# EAGLE design busyIdleDetectionStratasys (EAGLE 7.1.0)
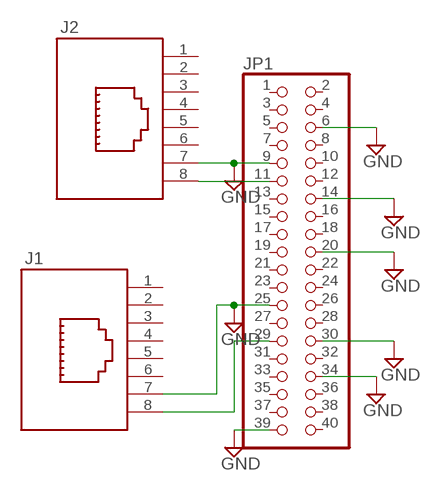
[diagram p0: schematic, sheet 1]

## Parts
J1  634008137221  [634008137221]
J2  634008137221  [634008137221]
JP1  PINHD-2X20  [2X20]

## Nets
GND: J1.7 J2.7 JP1.6 JP1.9 JP1.14 JP1.20 JP1.25 JP1.30 JP1.34 JP1.39
N$3: J2.8 JP1.11
N$4: J1.8 JP1.29
Unconnected: J1.1 J1.2 J1.3 J1.4 J1.5 J1.6 J2.1 J2.2 J2.3 J2.4 J2.5 J2.6 JP1.1 JP1.2 JP1.3 JP1.4 JP1.5 JP1.7 JP1.8 JP1.10 JP1.12 JP1.13 JP1.15 JP1.16 JP1.17 JP1.18 JP1.19 JP1.21 JP1.22 JP1.23 JP1.24 JP1.26 JP1.27 JP1.28 JP1.31 JP1.32 JP1.33 JP1.35 JP1.36 JP1.37 JP1.38 JP1.40

## Library data of the parts
J1 J2 = EAGLE-INPUT_OUTPUT_CONNECTORS-rev17d:634008137221: WR-MJ Horizontal Plastic SMT 8P8C Modular Jack Tab Down, 8 Pins=>Code : Con_I-O_MJ-H_Plastic_Down_634008137221 <http://katalog.we-online.de/media/images/eican/Con_I-O_MJ-H_Plastic_Down_634008137221_pf2.jpg> Details see: http://katalog.we-online.de/en/em/MJ_SMT_HORIZONTAL_PLASTIC_8P8C_TAB_DOWN/634008137221 Created 2014-07-10, Karrer Zheng 2014 (C) Würth Elektronik
JP1 = pinhead:PINHD-2X20: PIN HEADER

## Board
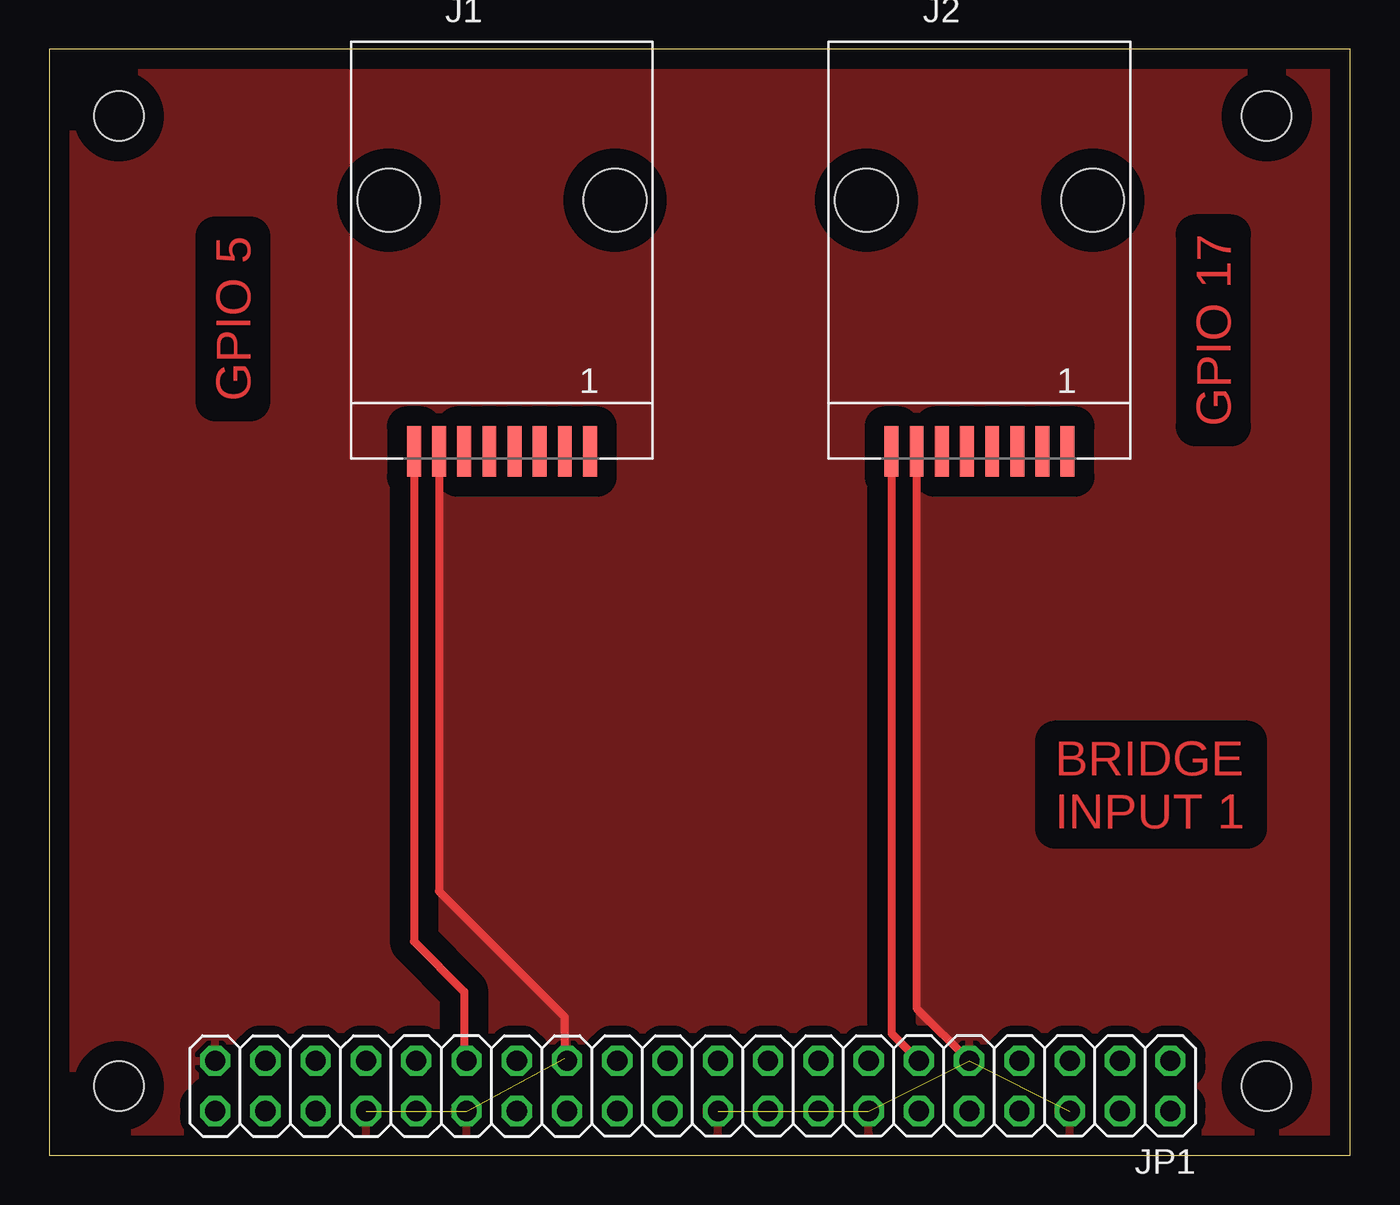
[diagram p1: board, top side]

Size 65.71 x 55.87 mm. Coordinates in mm from the lower left corner, seen from the top.
Outline: 0,0 65.71,0 65.71,55.87 0,55.87 0,0
Copper layers (1*16): Top 0.035mm / dielectric 1.5mm / Bottom 0.035mm
Design rules "default": minimum track width 10mil, minimum drill 24mil, track to track 8mil, track to pad 8mil, pad to pad 8mil, via to via 8mil, smd to smd 8mil, copper to edge 40mil, drill to drill 8mil, minimum pad ring 10mil, minimum via ring 8mil, stop-mask expansion 4mil, vias tented up to drill 0mil, thermal gap 10mil
Holes 2.5 mm at 3.5,3.5 61.5,3.5 3.5,52.5 61.5,52.5

### Footprints (pad centres in the part's own frame; a part is rotated, then mirrored left to right if it is on the bottom)
634008137221 = smd 0.7 x 2.54: 1 4.445,0; 2 3.175,0; 3 1.905,0; 4 0.635,0; 5 -0.635,0; 6 -1.905,0; 7 -3.175,0; 8 -4.445,0 | hole 3.17: 5.715,12.7; -5.715,12.7
2X20 = drill 1.016 octagon: 1 -24.13,-1.27; 2 -24.13,1.27; 3 -21.59,-1.27; 4 -21.59,1.27; 5 -19.05,-1.27; 6 -19.05,1.27; 7 -16.51,-1.27; 8 -16.51,1.27; 9 -13.97,-1.27; 10 -13.97,1.27; 11 -11.43,-1.27; 12 -11.43,1.27; 13 -8.89,-1.27; 14 -8.89,1.27; 15 -6.35,-1.27; 16 -6.35,1.27; 17 -3.81,-1.27; 18 -3.81,1.27; 19 -1.27,-1.27; 20 -1.27,1.27; 21 1.27,-1.27; 22 1.27,1.27; 23 3.81,-1.27; 24 3.81,1.27; 25 6.35,-1.27; 26 6.35,1.27; 27 8.89,-1.27; 28 8.89,1.27; 29 11.43,-1.27; 30 11.43,1.27; 31 13.97,-1.27; 32 13.97,1.27; 33 16.51,-1.27; 34 16.51,1.27; 35 19.05,-1.27; 36 19.05,1.27; 37 21.59,-1.27; 38 21.59,1.27; 39 24.13,-1.27; 40 24.13,1.27

### Placement (x,y rotation side)
J1  22.86,35.56 0 top
J2  46.99,35.56 0 top
JP1  32.5,3.5 180 top

### Tracks (layer width: path | path; a pad name or v marks a point on that pad's centre or on a via)
GND  (5 unrouted)
  Top 0.406: J1.7 19.68,13.34 26.04,6.99 26.04,4.88 JP1.25 | J2.7 43.81,7.42 JP1.9
  pour Top (isolate 1.016): 0,55.88 66.04,55.88 66.04,0 0,0
N$3
  Top 0.406: J2.8 42.55,6.16 JP1.11
N$4
  Top 0.406: J1.8 18.41,10.79 20.95,8.26 20.95,4.88 JP1.29

### Text on the board
Top: GPIO 5 | GPIO 17 | BRIDGE / INPUT 1